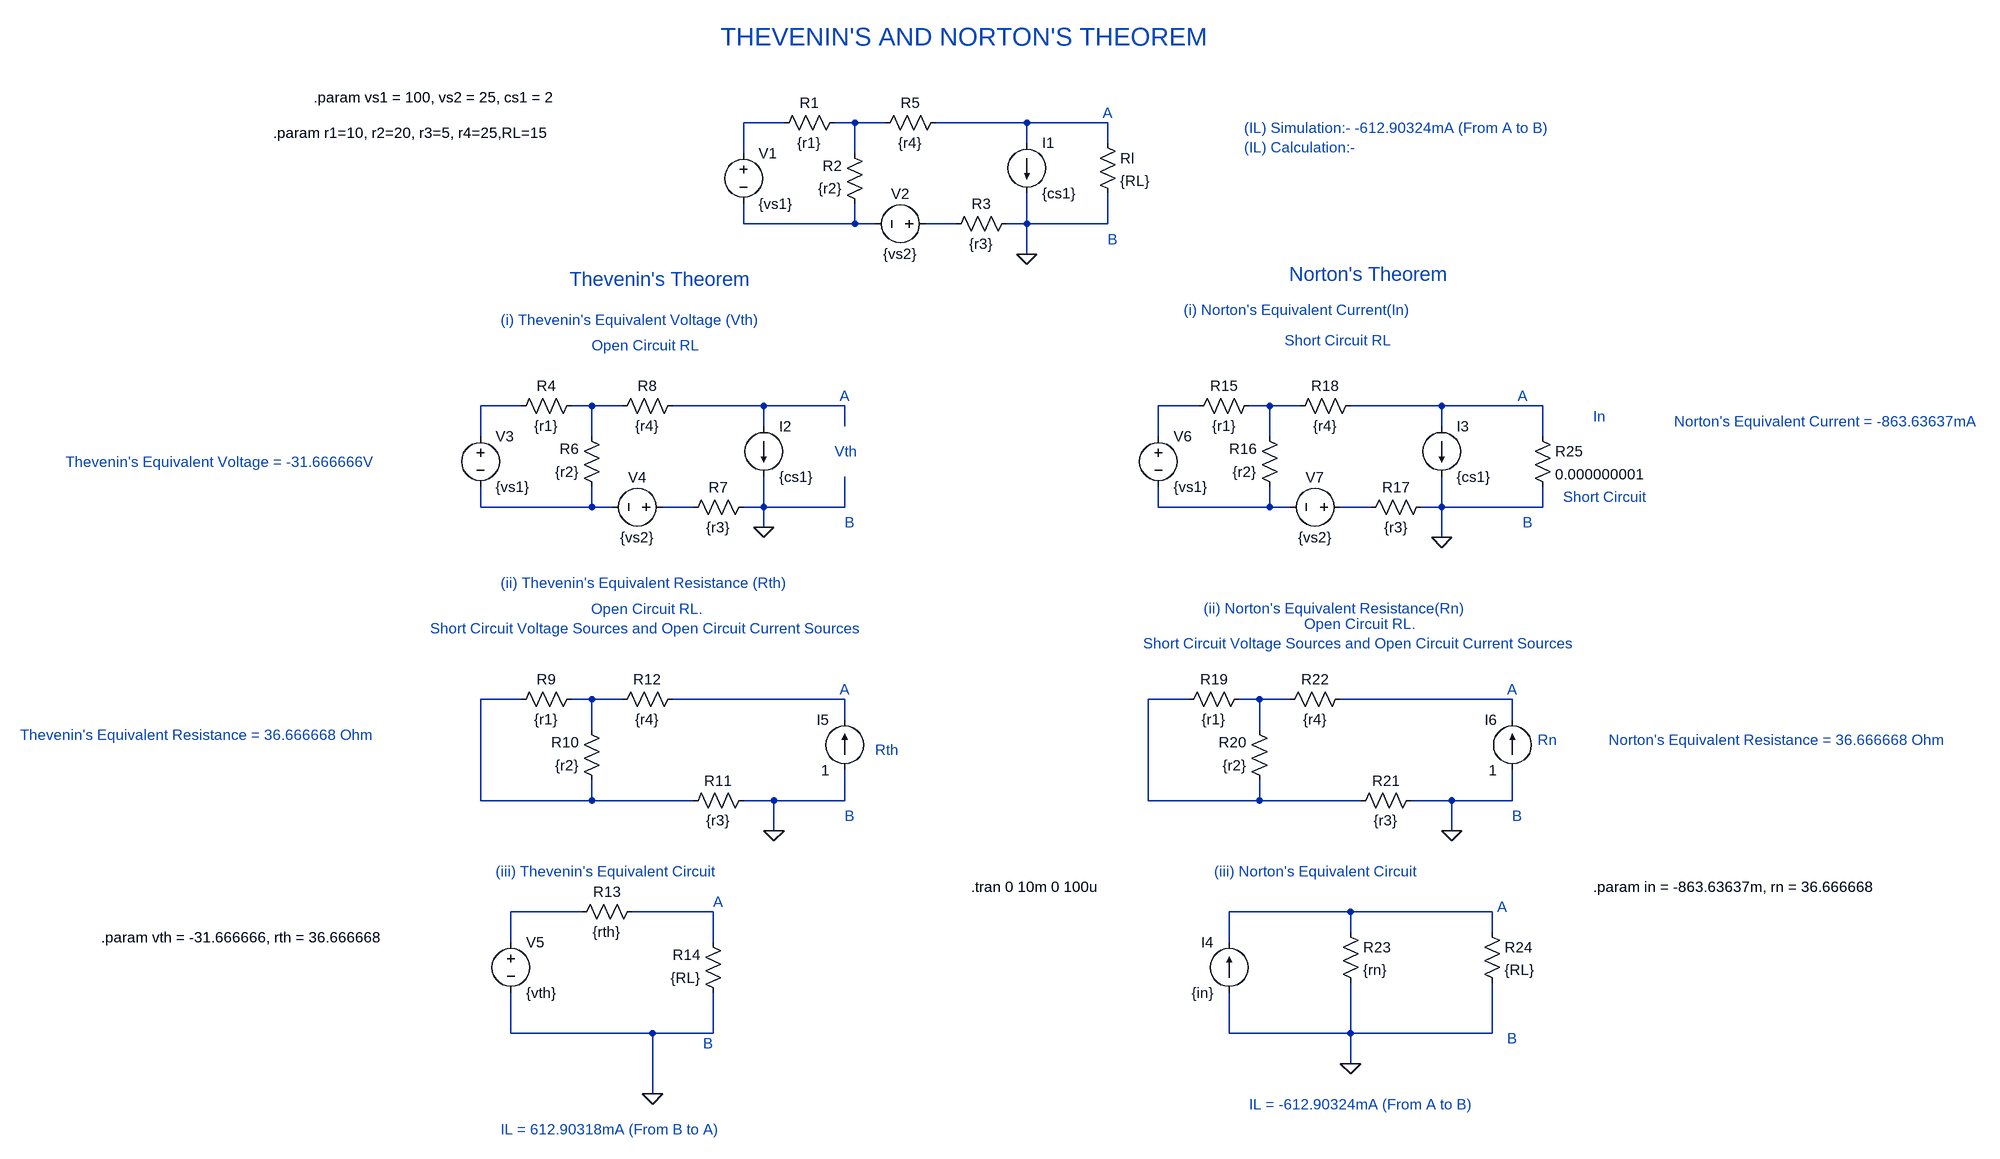
[diagram p0: schematic Thevenin's_Norton's_Theorem_1.asc]
Thevenin's_Norton's_Theorem_1.asc, the LTspice schematic file:
Version 4
SHEET 1 1828 1416
WIRE -128 -192 -192 -192
WIRE -16 -192 -48 -192
WIRE 32 -192 -16 -192
WIRE 256 -192 112 -192
WIRE 384 -192 256 -192
WIRE 256 -160 256 -192
WIRE 384 -160 384 -192
WIRE -192 -144 -192 -192
WIRE -16 -144 -16 -192
WIRE -192 -32 -192 -64
WIRE -16 -32 -16 -64
WIRE -16 -32 -192 -32
WIRE 16 -32 -16 -32
WIRE 144 -32 96 -32
WIRE 256 -32 256 -80
WIRE 256 -32 224 -32
WIRE 384 -32 384 -80
WIRE 384 -32 256 -32
WIRE 256 16 256 -32
WIRE -544 256 -608 256
WIRE -432 256 -464 256
WIRE -384 256 -432 256
WIRE -160 256 -304 256
WIRE -32 256 -160 256
WIRE 528 256 464 256
WIRE 640 256 608 256
WIRE 688 256 640 256
WIRE 912 256 768 256
WIRE 1072 256 912 256
WIRE -160 288 -160 256
WIRE -32 288 -32 256
WIRE 912 288 912 256
WIRE -608 304 -608 256
WIRE -432 304 -432 256
WIRE 464 304 464 256
WIRE 640 304 640 256
WIRE 1072 304 1072 256
WIRE -608 416 -608 384
WIRE -432 416 -432 384
WIRE -432 416 -608 416
WIRE -400 416 -432 416
WIRE -272 416 -320 416
WIRE -160 416 -160 368
WIRE -160 416 -192 416
WIRE -32 416 -32 368
WIRE -32 416 -160 416
WIRE 464 416 464 384
WIRE 640 416 640 384
WIRE 640 416 464 416
WIRE 672 416 640 416
WIRE 800 416 752 416
WIRE 912 416 912 368
WIRE 912 416 880 416
WIRE 1072 416 1072 384
WIRE 1072 416 912 416
WIRE -160 448 -160 416
WIRE 912 464 912 416
WIRE -544 720 -608 720
WIRE -432 720 -464 720
WIRE -384 720 -432 720
WIRE -32 720 -304 720
WIRE 512 720 448 720
WIRE 624 720 592 720
WIRE 672 720 624 720
WIRE 1024 720 752 720
WIRE -32 752 -32 720
WIRE 1024 752 1024 720
WIRE -432 768 -432 720
WIRE 624 768 624 720
WIRE -608 880 -608 720
WIRE -432 880 -432 848
WIRE -432 880 -608 880
WIRE -272 880 -432 880
WIRE -144 880 -192 880
WIRE -32 880 -32 832
WIRE -32 880 -144 880
WIRE 448 880 448 720
WIRE 624 880 624 848
WIRE 624 880 448 880
WIRE 784 880 624 880
WIRE 928 880 864 880
WIRE 1024 880 1024 832
WIRE 1024 880 928 880
WIRE -144 928 -144 880
WIRE 928 928 928 880
WIRE -448 1056 -560 1056
WIRE -240 1056 -368 1056
WIRE 768 1056 576 1056
WIRE 992 1056 768 1056
WIRE 768 1088 768 1056
WIRE 992 1088 992 1056
WIRE -560 1104 -560 1056
WIRE -240 1104 -240 1056
WIRE 576 1104 576 1056
WIRE -560 1248 -560 1184
WIRE -336 1248 -560 1248
WIRE -240 1248 -240 1184
WIRE -240 1248 -336 1248
WIRE 576 1248 576 1184
WIRE 768 1248 768 1168
WIRE 768 1248 576 1248
WIRE 992 1248 992 1168
WIRE 992 1248 768 1248
WIRE 768 1296 768 1248
WIRE -336 1344 -336 1248
FLAG 256 16 0
FLAG -160 448 0
FLAG -144 928 0
FLAG -336 1344 0
FLAG 912 464 0
FLAG 928 928 0
FLAG 768 1296 0
SYMBOL voltage -192 -160 R0
WINDOW 123 0 0 Left 0
WINDOW 39 0 0 Left 0
SYMATTR InstName V1
SYMATTR Value {vs1}
SYMBOL voltage 112 -32 R90
WINDOW 0 -32 56 VBottom 2
WINDOW 3 32 56 VTop 2
WINDOW 123 0 0 Left 0
WINDOW 39 0 0 Left 0
SYMATTR InstName V2
SYMATTR Value {vs2}
SYMBOL current 256 -160 R0
WINDOW 123 0 0 Left 0
WINDOW 39 0 0 Left 0
SYMATTR InstName I1
SYMATTR Value {cs1}
SYMBOL res -32 -208 R90
WINDOW 0 0 56 VBottom 2
WINDOW 3 32 56 VTop 2
SYMATTR InstName R1
SYMATTR Value {r1}
SYMBOL res 0 -48 R180
WINDOW 0 36 76 Left 2
WINDOW 3 36 40 Left 2
SYMATTR InstName R2
SYMATTR Value {r2}
SYMBOL res 128 -16 R270
WINDOW 0 32 56 VTop 2
WINDOW 3 0 56 VBottom 2
SYMATTR InstName R3
SYMATTR Value {r3}
SYMBOL res 368 -176 R0
SYMATTR InstName Rl
SYMATTR Value {RL}
SYMBOL res 128 -208 R90
WINDOW 0 0 56 VBottom 2
WINDOW 3 32 56 VTop 2
SYMATTR InstName R5
SYMATTR Value {r4}
SYMBOL voltage -608 288 R0
WINDOW 123 0 0 Left 0
WINDOW 39 0 0 Left 0
SYMATTR InstName V3
SYMATTR Value {vs1}
SYMBOL voltage -304 416 R90
WINDOW 0 -32 56 VBottom 2
WINDOW 3 32 56 VTop 2
WINDOW 123 0 0 Left 0
WINDOW 39 0 0 Left 0
SYMATTR InstName V4
SYMATTR Value {vs2}
SYMBOL current -160 288 R0
WINDOW 123 0 0 Left 0
WINDOW 39 0 0 Left 0
SYMATTR InstName I2
SYMATTR Value {cs1}
SYMBOL res -448 240 R90
WINDOW 0 0 56 VBottom 2
WINDOW 3 32 56 VTop 2
SYMATTR InstName R4
SYMATTR Value {r1}
SYMBOL res -416 400 R180
WINDOW 0 36 76 Left 2
WINDOW 3 36 40 Left 2
SYMATTR InstName R6
SYMATTR Value {r2}
SYMBOL res -288 432 R270
WINDOW 0 32 56 VTop 2
WINDOW 3 0 56 VBottom 2
SYMATTR InstName R7
SYMATTR Value {r3}
SYMBOL res -288 240 R90
WINDOW 0 0 56 VBottom 2
WINDOW 3 32 56 VTop 2
SYMATTR InstName R8
SYMATTR Value {r4}
SYMBOL res -448 704 R90
WINDOW 0 0 56 VBottom 2
WINDOW 3 32 56 VTop 2
SYMATTR InstName R9
SYMATTR Value {r1}
SYMBOL res -416 864 R180
WINDOW 0 36 76 Left 2
WINDOW 3 36 40 Left 2
SYMATTR InstName R10
SYMATTR Value {r2}
SYMBOL res -288 896 R270
WINDOW 0 32 56 VTop 2
WINDOW 3 0 56 VBottom 2
SYMATTR InstName R11
SYMATTR Value {r3}
SYMBOL res -288 704 R90
WINDOW 0 0 56 VBottom 2
WINDOW 3 32 56 VTop 2
SYMATTR InstName R12
SYMATTR Value {r4}
SYMBOL voltage -560 1088 R0
WINDOW 123 0 0 Left 0
WINDOW 39 0 0 Left 0
SYMATTR InstName V5
SYMATTR Value {vth}
SYMBOL res -352 1040 R90
WINDOW 0 0 56 VBottom 2
WINDOW 3 32 56 VTop 2
SYMATTR InstName R13
SYMATTR Value {rth}
SYMBOL res -224 1200 R180
WINDOW 0 36 76 Left 2
WINDOW 3 36 40 Left 2
SYMATTR InstName R14
SYMATTR Value {RL}
SYMBOL voltage 464 288 R0
WINDOW 123 0 0 Left 0
WINDOW 39 0 0 Left 0
SYMATTR InstName V6
SYMATTR Value {vs1}
SYMBOL voltage 768 416 R90
WINDOW 0 -32 56 VBottom 2
WINDOW 3 32 56 VTop 2
WINDOW 123 0 0 Left 0
WINDOW 39 0 0 Left 0
SYMATTR InstName V7
SYMATTR Value {vs2}
SYMBOL current 912 288 R0
WINDOW 123 0 0 Left 0
WINDOW 39 0 0 Left 0
SYMATTR InstName I3
SYMATTR Value {cs1}
SYMBOL res 624 240 R90
WINDOW 0 0 56 VBottom 2
WINDOW 3 32 56 VTop 2
SYMATTR InstName R15
SYMATTR Value {r1}
SYMBOL res 656 400 R180
WINDOW 0 36 76 Left 2
WINDOW 3 36 40 Left 2
SYMATTR InstName R16
SYMATTR Value {r2}
SYMBOL res 784 432 R270
WINDOW 0 32 56 VTop 2
WINDOW 3 0 56 VBottom 2
SYMATTR InstName R17
SYMATTR Value {r3}
SYMBOL res 784 240 R90
WINDOW 0 0 56 VBottom 2
WINDOW 3 32 56 VTop 2
SYMATTR InstName R18
SYMATTR Value {r4}
SYMBOL res 608 704 R90
WINDOW 0 0 56 VBottom 2
WINDOW 3 32 56 VTop 2
SYMATTR InstName R19
SYMATTR Value {r1}
SYMBOL res 640 864 R180
WINDOW 0 36 76 Left 2
WINDOW 3 36 40 Left 2
SYMATTR InstName R20
SYMATTR Value {r2}
SYMBOL res 768 896 R270
WINDOW 0 32 56 VTop 2
WINDOW 3 0 56 VBottom 2
SYMATTR InstName R21
SYMATTR Value {r3}
SYMBOL res 768 704 R90
WINDOW 0 0 56 VBottom 2
WINDOW 3 32 56 VTop 2
SYMATTR InstName R22
SYMATTR Value {r4}
SYMBOL current 576 1184 R180
WINDOW 0 24 80 Left 2
WINDOW 3 24 0 Left 2
WINDOW 123 0 0 Left 0
WINDOW 39 0 0 Left 0
SYMATTR InstName I4
SYMATTR Value {in}
SYMBOL res 752 1072 R0
SYMATTR InstName R23
SYMATTR Value {rn}
SYMBOL res 976 1072 R0
SYMATTR InstName R24
SYMATTR Value {RL}
SYMBOL current -32 832 R180
WINDOW 0 24 80 Left 2
WINDOW 3 24 0 Left 2
WINDOW 123 0 0 Left 0
WINDOW 39 0 0 Left 0
SYMATTR InstName I5
SYMATTR Value 1
SYMBOL current 1024 832 R180
WINDOW 0 24 80 Left 2
WINDOW 3 24 0 Left 2
WINDOW 123 0 0 Left 0
WINDOW 39 0 0 Left 0
SYMATTR InstName I6
SYMATTR Value 1
SYMBOL res 1056 288 R0
SYMATTR InstName R25
SYMATTR Value 0.000000001
TEXT 152 -328 Center 4 ;THEVENIN'S AND NORTON'S THEOREM
TEXT 376 -208 Left 2 ;A
TEXT 384 -8 Left 2 ;B
TEXT -320 56 Center 3 ;Thevenin's Theorem
TEXT 800 48 Center 3 ;Norton's Theorem
TEXT -576 120 Left 2 ;(i) Thevenin's Equivalent Voltage (Vth)
TEXT -576 536 Left 2 ;(ii) Thevenin's Equivalent Resistance (Rth)
TEXT -584 992 Left 2 ;(iii) Thevenin's Equivalent Circuit
TEXT 504 104 Left 2 ;(i) Norton's Equivalent Current(In)
TEXT 536 576 Left 2 ;(ii) Norton's Equivalent Resistance(Rn)
TEXT 552 992 Left 2 ;(iii) Norton's Equivalent Circuit
TEXT -432 160 Left 2 ;Open Circuit RL
TEXT -40 240 Left 2 ;A
TEXT -32 440 Left 2 ;B
TEXT -344 592 Center 2 ;Open Circuit RL.\nShort Circuit Voltage Sources and Open Circuit Current Sources
TEXT -40 704 Left 2 ;A
TEXT -32 904 Left 2 ;B
TEXT 1032 240 Left 2 ;A
TEXT 1040 440 Left 2 ;B
TEXT 664 152 Left 2 ;Short Circuit RL
TEXT 1016 704 Left 2 ;A
TEXT 1024 904 Left 2 ;B
TEXT 784 616 Center 2 ;Open Circuit RL.\nShort Circuit Voltage Sources and Open Circuit Current Sources
TEXT -240 1040 Left 2 ;A
TEXT -256 1264 Left 2 ;B
TEXT 1000 1048 Left 2 ;A
TEXT 1016 1256 Left 2 ;B
TEXT -872 -232 Left 2 !.param vs1 = 100, vs2 = 25, cs1 = 2
TEXT -936 -176 Left 2 !.param r1=10, r2=20, r3=5, r4=25,RL=15
TEXT -48 328 Left 2 ;Vth
TEXT 16 800 Left 2 ;Rth
TEXT 1152 272 Left 2 ;In
TEXT 1064 784 Left 2 ;Rn
TEXT -1208 1096 Left 2 !.param vth = -31.666666, rth = 36.666668
TEXT 1152 1016 Left 2 !.param in = -863.63637m, rn = 36.666668
TEXT 1104 400 Left 2 ;Short Circuit
TEXT 600 -184 Left 2 ;(IL) Simulation:- -612.90324mA (From A to B)\n(IL) Calculation:-
TEXT -1264 344 Left 2 ;Thevenin's Equivalent Voltage = -31.666666V
TEXT -1336 776 Left 2 ;Thevenin's Equivalent Resistance = 36.666668 Ohm
TEXT 1280 280 Left 2 ;Norton's Equivalent Current = -863.63637mA
TEXT 1176 784 Left 2 ;Norton's Equivalent Resistance = 36.666668 Ohm
TEXT -576 1400 Left 2 ;IL = 612.90318mA (From B to A)
TEXT 608 1360 Left 2 ;IL = -612.90324mA (From A to B)
TEXT 168 1016 Left 2 !.tran 0 10m 0 100u

The netlist it stands for:
* Thevenin's_Norton's_Theorem_1.asc
V1 N001 N004 {vs1}
V2 N005 N004 {vs2}
I1 N003 0 {cs1}
R1 N002 N001 {r1}
R2 N004 N002 {r2}
R3 N005 0 {r3}
Rl N003 0 {RL}
R5 N003 N002 {r4}
V3 N006 N012 {vs1}
V4 N013 N012 {vs2}
I2 N008 0 {cs1}
R4 N007 N006 {r1}
R6 N012 N007 {r2}
R7 N013 0 {r3}
R8 N008 N007 {r4}
R9 N017 N016 {r1}
R10 N016 N017 {r2}
R11 N016 0 {r3}
R12 N018 N017 {r4}
V5 N022 0 {vth}
R13 N023 N022 {rth}
R14 0 N023 {RL}
V6 N009 N014 {vs1}
V7 N015 N014 {vs2}
I3 N011 0 {cs1}
R15 N010 N009 {r1}
R16 N014 N010 {r2}
R17 N015 0 {r3}
R18 N011 N010 {r4}
R19 N020 N019 {r1}
R20 N019 N020 {r2}
R21 N019 0 {r3}
R22 N021 N020 {r4}
I4 0 N024 {in}
R23 N024 0 {rn}
R24 N024 0 {RL}
I5 0 N018 1
I6 0 N021 1
R25 N011 0 0.000000001
* THEVENIN'S AND NORTON'S THEOREM
* A
* B
* Thevenin's Theorem
* Norton's Theorem
* (i) Thevenin's Equivalent Voltage (Vth)
* (ii) Thevenin's Equivalent Resistance (Rth)
* (iii) Thevenin's Equivalent Circuit
* (i) Norton's Equivalent Current(In)
* (ii) Norton's Equivalent Resistance(Rn)
* (iii) Norton's Equivalent Circuit
* Open Circuit RL
* A
* B
* Open Circuit RL.
* Short Circuit Voltage Sources and Open Circuit Current Sources
* A
* B
* A
* B
* Short Circuit RL
* A
* B
* Open Circuit RL.
* Short Circuit Voltage Sources and Open Circuit Current Sources
* A
* B
* A
* B
.param vs1 = 100, vs2 = 25, cs1 = 2
.param r1=10, r2=20, r3=5, r4=25,RL=15
* Vth
* Rth
* In
* Rn
.param vth = -31.666666, rth = 36.666668
.param in = -863.63637m, rn = 36.666668
* Short Circuit
* (IL) Simulation:- -612.90324mA (From A to B)
* (IL) Calculation:-
* Thevenin's Equivalent Voltage = -31.666666V
* Thevenin's Equivalent Resistance = 36.666668 Ohm
* Norton's Equivalent Current = -863.63637mA
* Norton's Equivalent Resistance = 36.666668 Ohm
* IL = 612.90318mA (From B to A)
* IL = -612.90324mA (From A to B)
.tran 0 10m 0 100u
.backanno
.end